# EasyEDA Pro project MSDRv2.eprj, schematic Schematic2
Board Name: V2.A1; Create Date: 2025-01-03; Page Name: P1; Project Name: MSDRv2; Schematic Name: Schematic2; Update Date: 2025-01-03; Company: EasyEDA.com; Drawn: EasyEDA; Page Size: A4; Part Number: JLCPCB-002; Reviewed: EasyEDA; Version: V0.1
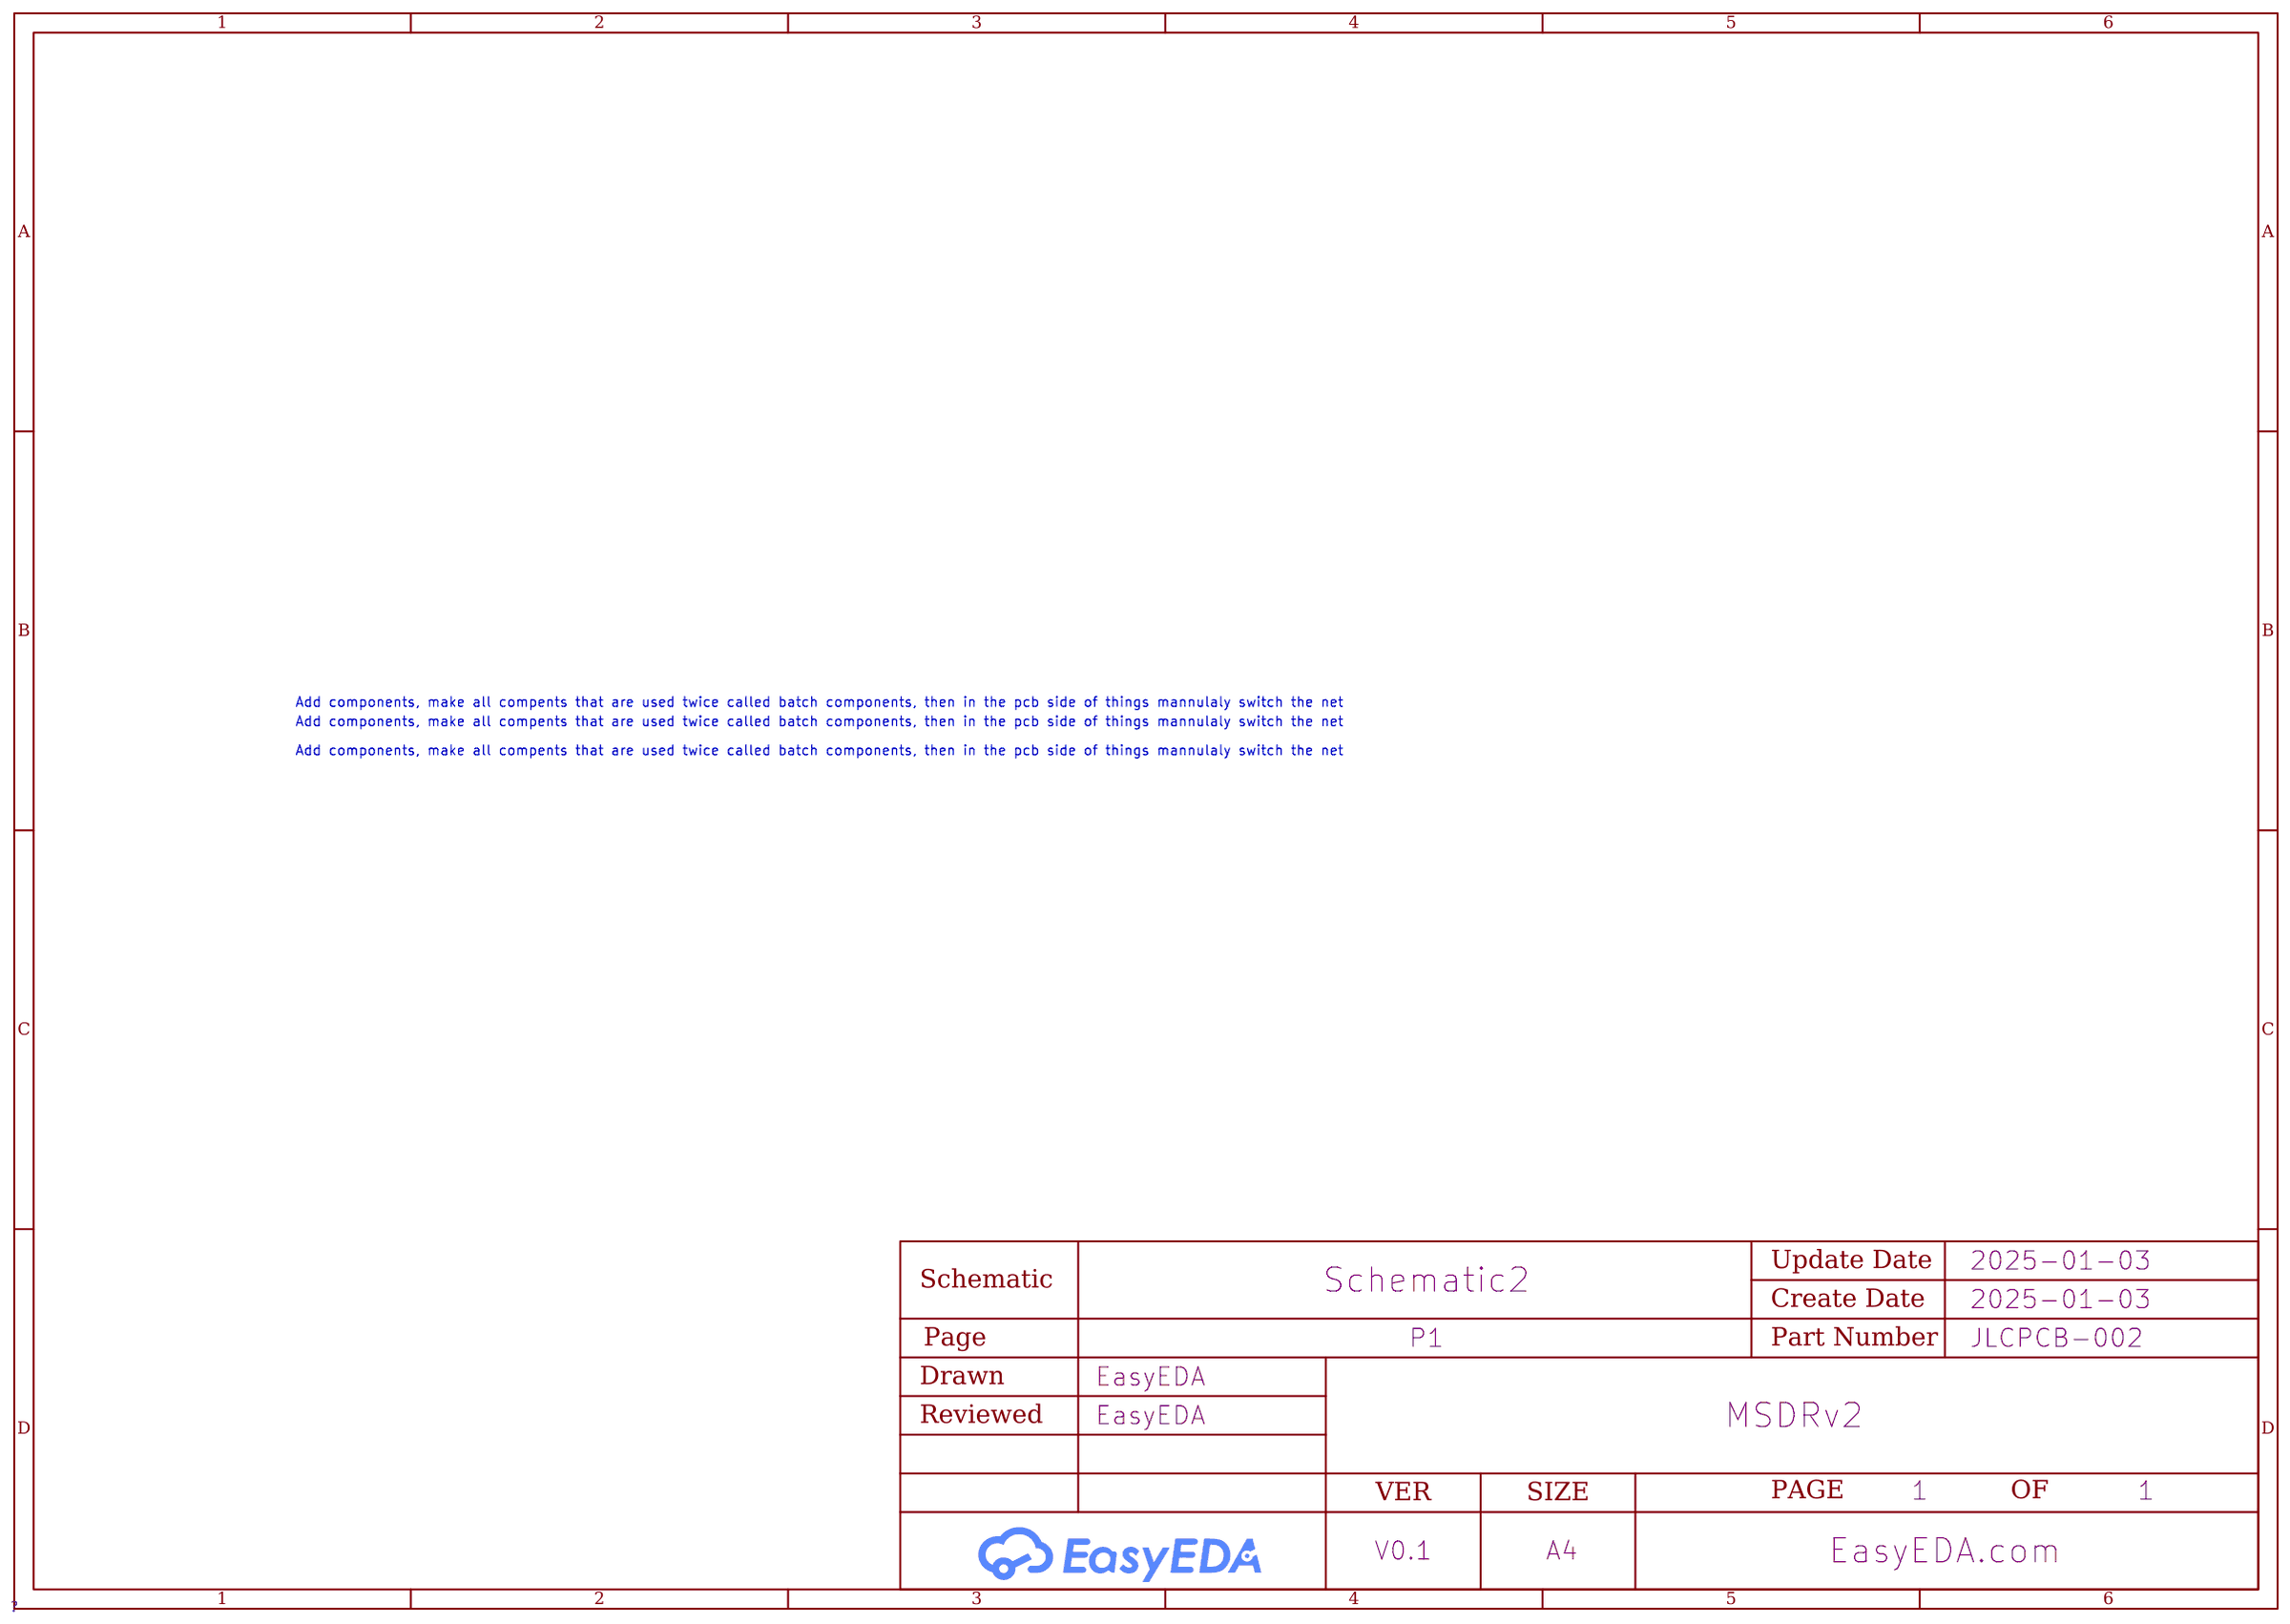
[diagram p4: schematic sheet]

## Parts
CBB1  -
CBB2  -
CBB3  -

## Nets
Net-(CBB1-): CBB1.(OUT4) CBB2.(OUT4) CBB3.(TXQN)

## Notes on the sheet
- Add components, make all compents that are used twice called batch components, then in the pcb side of things mannulaly switch the net
- Add components, make all compents that are used twice called batch components, then in the pcb side of things mannulaly switch the net
- Add components, make all compents that are used twice called batch components, then in the pcb side of things mannulaly switch the net
